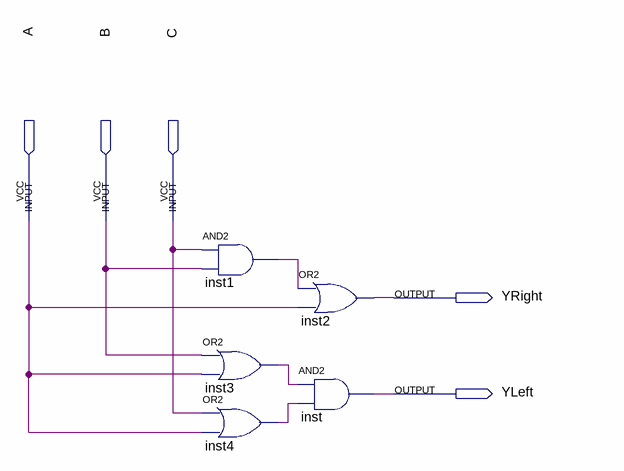
[diagram p0: schematic sheet]
// Quartus schematic dMogan_Bool_1.bdf as structural Verilog: 5 symbols, 5 pins
module dMogan_Bool_1 (
  input  A,
  input  B,
  input  C,
  output YRight,
  output YLeft
);

  wire inst1_out, inst3_out, inst4_out;

  and inst1 (inst1_out, C, B);
  or inst3 (inst3_out, B, A);
  or inst4 (inst4_out, C, A);
  or inst2 (YRight, inst1_out, A);
  and inst (YLeft, inst3_out, inst4_out);
endmodule
